# EAGLE design Lampen (EAGLE 9.2.0)
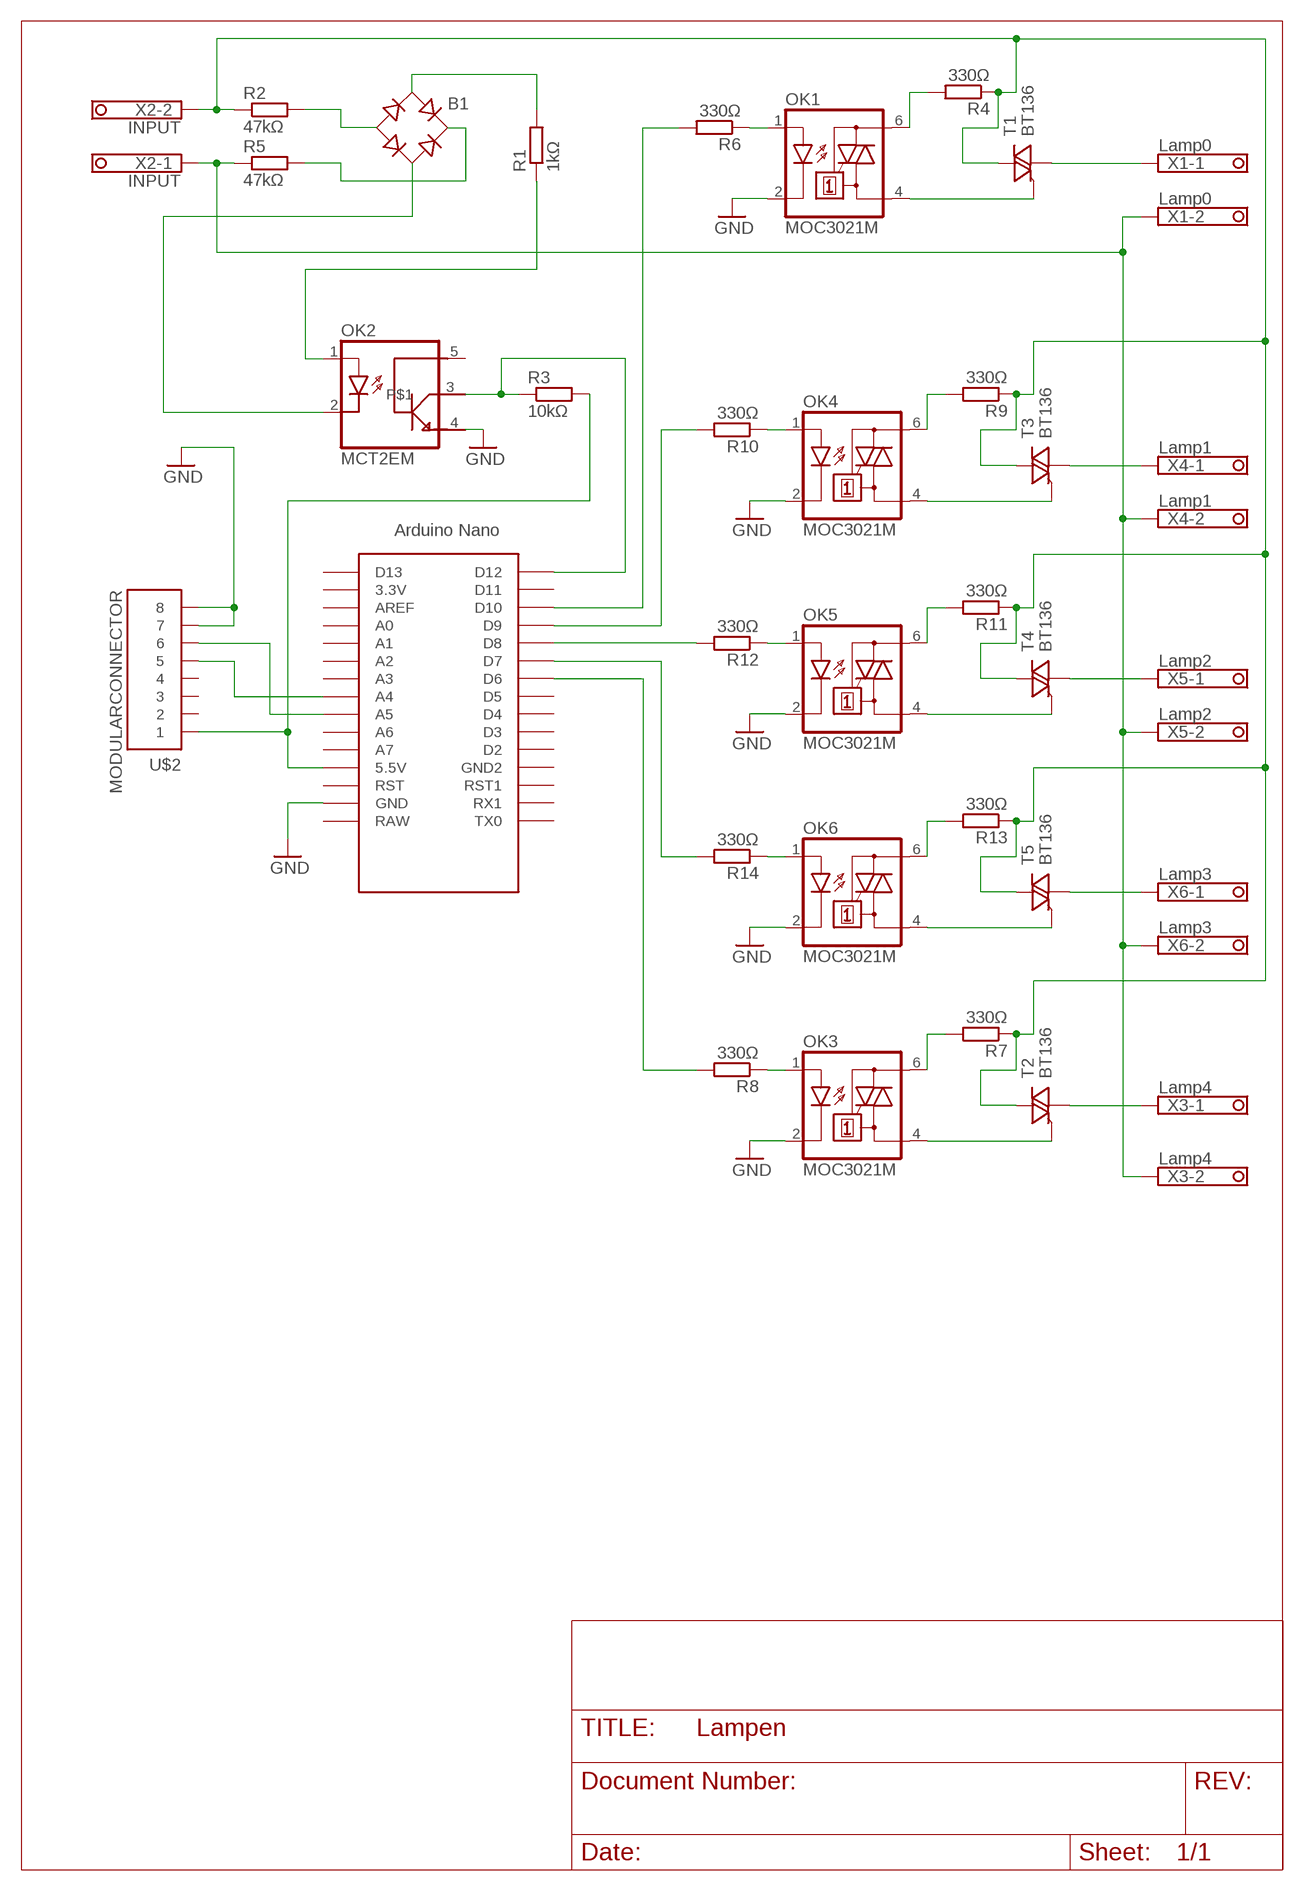
[diagram p0: schematic, sheet 1]

## Parts
B1  B250C1500G  [RB1A]
OK1  MOC3021M  MOC3021M10  [DIL06]
OK2  MCT2EM  MCT2EM21  [DIL06]
OK3  MOC3021M  MOC3021M10  [DIL06]
OK4  MOC3021M  MOC3021M10  [DIL06]
OK5  MOC3021M  MOC3021M10  [DIL06]
OK6  MOC3021M  MOC3021M10  [DIL06]
R1  1kΩ  R-EU_M1206  [M1206]
R2  47kΩ  R-EU_R2512  [R2512]
R3  10kΩ  R-EU_M1206  [M1206]
R4  330Ω  R-EU_M1206  [M1206]
R5  47kΩ  R-EU_R2512  [R2512]
R6  330Ω  R-EU_M1206  [M1206]
R7  330Ω  R-EU_M1206  [M1206]
R8  330Ω  R-EU_M1206  [M1206]
R9  330Ω  R-EU_M1206  [M1206]
R10  330Ω  R-EU_M1206  [M1206]
R11  330Ω  R-EU_M1206  [M1206]
R12  330Ω  R-EU_M1206  [M1206]
R13  330Ω  R-EU_M1206  [M1206]
R14  330Ω  R-EU_M1206  [M1206]
T1  BT136  [TO220DS]
T2  BT136  [TO220DS]
T3  BT136  [TO220DS]
T4  BT136  [TO220DS]
T5  BT136  [TO220DS]
U$1  NANO  [NANO]
U$2  MODULARCONNECTOR  [MA04-2]
X1  Lamp0  1751248  [1751248]
X2  INPUT  1751248  [1751248]
X3  Lamp4  1751248  [1751248]
X4  Lamp1  1751248  [1751248]
X5  Lamp2  1751248  [1751248]
X6  Lamp3  1751248  [1751248]

## Nets
GND: OK1.2(C) OK2.4(A1) OK3.2(C) OK4.2(C) OK5.2(C) OK6.2(C) U$1.GND U$2.7 U$2.8
N$1: B1.+ R5.2
N$2: R5.1 X1.2 X2.1 X3.2 X4.2 X5.2 X6.2
N$3: B1.AC1 R1.2
N$4: OK2.1(A) R1.1
N$5: B1.- R2.2
N$6: OK1.1(A) R6.1
N$7: B1.AC2 OK2.2(C)
N$8: OK2.3 R3.1 U$1.D12
N$9: R3.2 U$1.5V(5.5V) U$2.1
N$10: OK1.4(A1) T1.G
N$11: T1.A1 X1.1
N$12: U$1.A5 U$2.6
N$13: OK1.6(A2) R4.2
N$14: R6.2 U$1.D10
N$15: OK4.4(A1) T3.G
N$16: OK3.4(A1) T2.G
N$17: T2.A1 X3.1
N$18: U$1.A4 U$2.5
N$19: OK3.6(A2) R7.2
N$20: OK3.1(A) R8.1
N$21: T3.A1 X4.1
N$24: OK4.6(A2) R9.2
N$25: OK4.1(A) R10.1
N$26: R10.2 U$1.D9
N$27: OK5.4(A1) T4.G
N$28: T4.A1 X5.1
N$30: OK5.6(A2) R11.2
N$31: OK5.1(A) R12.1
N$33: OK6.4(A1) T5.G
N$34: T5.A1 X6.1
N$35: R2.1 R4.1 R7.1 R9.1 R11.1 R13.1 T1.A2 T2.A2 T3.A2 T4.A2 T5.A2 X2.2
N$36: OK6.6(A2) R13.2
N$37: OK6.1(A) R14.1
N$38: R14.2 U$1.D7
N$39: R8.2 U$1.D6
N$40: R12.2 U$1.D8
Unconnected: OK2.5(A2) U$1.3.3V U$1.A0 U$1.A1 U$1.A2 U$1.A3 U$1.A6 U$1.A7 U$1.AREF U$1.D2 U$1.D3 U$1.D4 U$1.D5 U$1.D11 U$1.D13 U$1.GND1(GND2) U$1.ICSP1 U$1.ICSP2 U$1.ICSP3 U$1.ICSP4 U$1.ICSP5 U$1.ICSP6 U$1.RAW U$1.RST U$1.RST1 U$1.RX1 U$1.TX0 U$2.2 U$2.3 U$2.4

## Library data of the parts
B1 = dimmer_lampen:B250C1500G: RECTIFIER 1 A
OK1 OK3-OK6 = dimmer_lampen:MOC3021M: RANDOM-PHASE OPTOISOLATORS TRIAC DRIVER OUTPUT Source: http://www.fairchildsemi.com MOC3020-M.pdf; MF: FAIRCHILD SEMICONDUCTOR; MPN: MOC3010-M; OC_FARNELL: 1505423; OC_NEWARK: 72K8892
OK2 = dimmer_lampen2:MCT2EM: RANDOM-PHASE OPTOISOLATORS TRIAC DRIVER OUTPUT; MF: FAIRCHILD SEMICONDUCTOR; MPN: MOC3021-M; OC_FARNELL: 1021365; OC_NEWARK: 95B7895
R1-R14 = rcl:R-EU_: RESISTOR, European symbol; SPICEPREFIX: R
T1-T5 = dimmer_lampen:BT136: TRIAC
U$1 = Arduino-clone:NANO: Arduino Nano
U$2 = Main_lib:MODULARCONNECTOR
X1-X6 = dimmer_lampen:1751248: MKDS 1/ 2-3,5 Printklemme Nennstrom: 10 A Bemessungsspannung: 160 V Raster: 3,5 mm Polzahl: 2 Montageart: Löten Anschlussart: Schraubanschluss Anschlussrichtung vom Leiter zur Platine: 0° Source: http://eshop.phoenixcontact.com .. 1751248.pdf

## Board
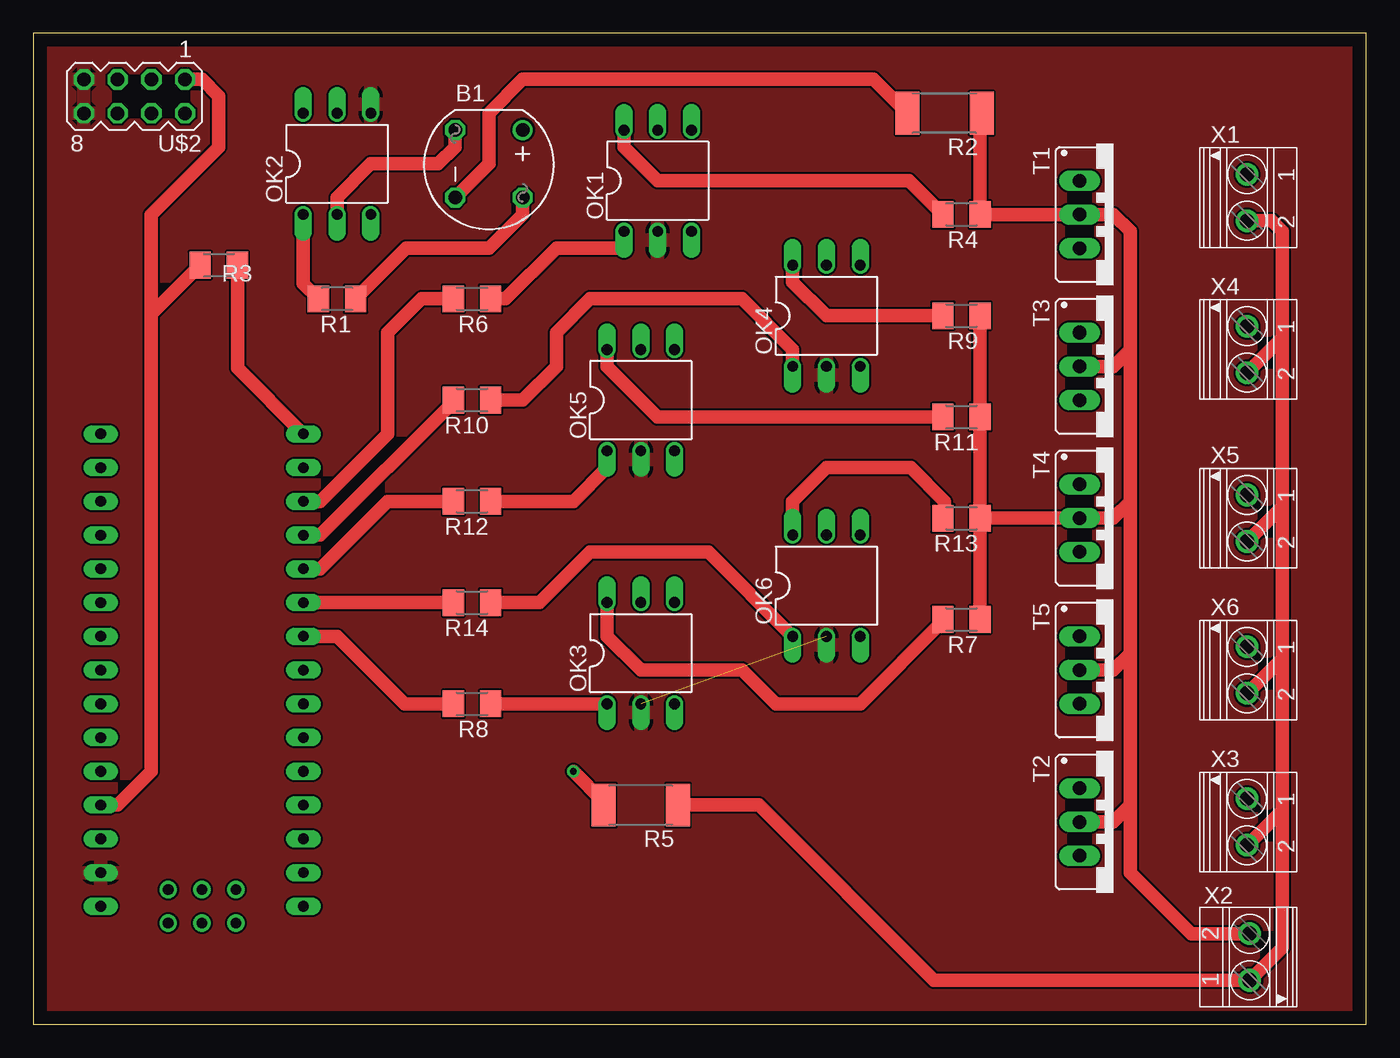
[diagram p1: board, top side]
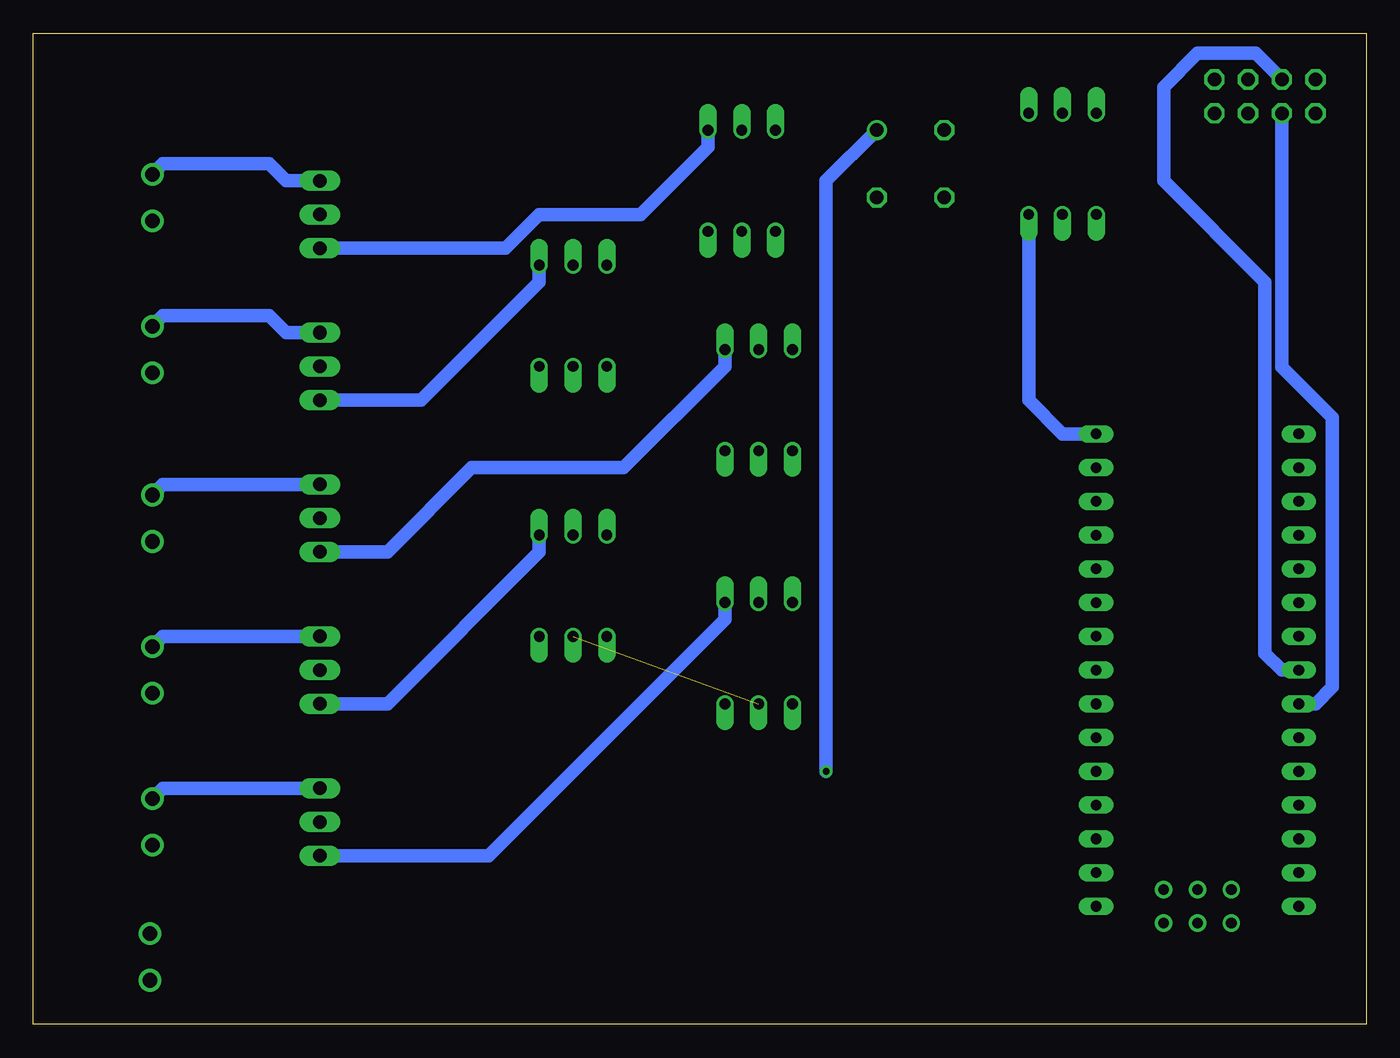
[diagram p2: board, bottom side, seen from below]

Size 100.31 x 74.6 mm. Coordinates in mm from the lower left corner, seen from the top.
Outline: 0,0 100.31,0 100.31,74.6 0,74.6 0,0
Copper layers (1*16): Top 0.035mm / dielectric 1.5mm / Bottom 0.035mm
Design rules "default": minimum track width 6mil, minimum drill 0.35mm, track to track 6mil, track to pad 6mil, pad to pad 6mil, via to via 6mil, smd to smd 6mil, copper to edge 40mil, drill to drill 6mil, minimum pad ring 10mil, minimum via ring 8mil, stop-mask expansion 4mil, vias tented up to drill 0mil, thermal gap 10mil

### Footprints (pad centres in the part's own frame; a part is rotated, then mirrored left to right if it is on the bottom)
RB1A = drill 1.016: + -2.54,2.54 | drill 1.016 octagon: - 2.54,-2.54; AC1 2.54,2.54; AC2 -2.54,-2.54
DIL06 = drill 0.813 offset: 1 -2.54,-3.81; 2 0,-3.81; 3 2.54,-3.81; 4 2.54,3.81; 5 0,3.81; 6 -2.54,3.81
M1206 = smd 1.6 x 2: 1 -1.4,0; 2 1.4,0
R2512 = smd 1.8 x 3.2: 1 -2.8,0; 2 2.8,0
TO220DS = drill 1.016 long: A1 -2.54,-2.54; A2 0,-2.54; G 2.54,-2.54
NANO = drill 0.8 long: 3.3V -10.16,24.13; 5V -10.16,-1.27; A0 -10.16,19.05; A1 -10.16,16.51; A2 -10.16,13.97; A3 -10.16,11.43; A4 -10.16,8.89; A5 -10.16,6.35; A6 -10.16,3.81; A7 -10.16,1.27; AREF -10.16,21.59; D2 5.08,1.27; D3 5.08,3.81; D4 5.08,6.35; D5 5.08,8.89; D6 5.08,11.43; D7 5.08,13.97; D8 5.08,16.51; D9 5.08,19.05; D10 5.08,21.59; D11 5.08,24.13; D12 5.08,26.67; D13 -10.16,26.67; GND -10.16,-6.35; GND1 5.08,-1.27; RAW -10.16,-8.89; RST -10.16,-3.81; RST1 5.08,-3.81; RX1 5.08,-6.35; TX0 5.08,-8.89 | drill 0.8: ICSP1 -5.08,-10.16; ICSP2 -5.08,-7.62; ICSP3 -2.54,-10.16; ICSP4 -2.54,-7.62; ICSP5 0,-10.16; ICSP6 0,-7.62
MA04-2 = drill 1.016 octagon: 1 -3.81,-1.27; 2 -3.81,1.27; 3 -1.27,-1.27; 4 -1.27,1.27; 5 1.27,-1.27; 6 1.27,1.27; 7 3.81,-1.27; 8 3.81,1.27
1751248 = drill 1.1 pad 1.7: 1 -1.75,-0.1; 2 1.75,-0.1

### Placement (x,y rotation side)
B1  34.29,64.77 270 top
OK1  46.99,63.5 0 top
OK2  22.86,64.77 0 top
OK3  45.72,27.94 0 top
OK4  59.69,53.34 0 top
OK5  45.72,46.99 0 top
OK6  59.69,33.02 0 top
R1  22.86,54.61 0 top
R2  68.58,68.58 180 top
R3  13.97,57.15 180 top
R4  69.85,60.96 180 top
R5  45.72,16.51 180 top
R6  33.02,54.61 180 top
R7  69.85,30.48 180 top
R8  33.02,24.13 180 top
R9  69.85,53.34 180 top
R10  33.02,46.99 180 top
R11  69.85,45.72 180 top
R12  33.02,39.37 180 top
R13  69.85,38.1 180 top
R14  33.02,31.75 180 top
T1  81.28,60.96 270 top
T2  81.28,15.24 270 top
T3  81.28,49.53 270 top
T4  81.28,38.1 270 top
T5  81.28,26.67 270 top
U$1  15.24,17.78 0 top
U$2  7.62,69.85 180 top
X1  91.44,62.23 270 top
X2  91.44,5.08 90 top
X3  91.44,15.24 270 top
X4  91.44,50.8 270 top
X5  91.44,38.1 270 top
X6  91.44,26.67 270 top

### Tracks (layer width: path | path; a pad name or v marks a point on that pad's centre or on a via)
GND  (1 unrouted)
  pour Top: 0,73.66 0,0 100.33,0 100.33,74.93 0,74.93
N$1  (via drill 0.5)
  Top 1: R5.2 42.92,16.77 v40.64,19.05
  Bottom 1: B1.+ 40.64,63.5 v40.64,19.05
N$2
  Top 1: X1.2 93.19,60.48 93.98,59.69 93.98,51.69 | 93.98,51.69 93.98,38.99 | 93.98,38.99 93.98,27.56 | 93.98,27.56 93.98,16.13 | 93.98,16.13 X3.2 | 93.98,27.56 X6.2 | 93.98,38.99 X5.2 | 93.98,51.69 X4.2 | 93.98,16.13 93.98,5.77 X2.1 67.79,3.33 54.61,16.51 R5.1
N$3
  Top 1: R1.2 28.07,58.42 34.29,58.42 36.83,60.96 B1.AC1
N$4
  Top 1: OK2.1 20.32,55.75 R1.1
N$5
  Top 1: B1.- 34.29,64.77 34.29,68.58 36.83,71.12 63.24,71.12 R2.2
N$6
  Top 1: R6.1 35.56,54.61 39.37,58.42 44.45,58.42 OK1.1
N$7
  Top 1: OK2.2 22.86,62.23 25.4,64.77 30.48,64.77 31.75,66.04 B1.AC2
N$8
  Top 1: U$1.D12 15.37,49.4 R3.1
  Bottom 1: U$1.D12 22.86,44.45 25.4,46.99 OK2.3
N$9
  Top 1: U$2.1 12.7,71.12 13.97,69.85 13.97,66.04 8.89,60.96 8.89,53.47 | U$1.5V 6.35,16.51 8.89,19.05 8.89,50.8 8.89,53.47 | R3.2 8.89,53.47
N$10
  Bottom 1: OK1.4 49.53,66.04 54.61,60.96 62.23,60.96 64.77,58.42 T1.G
N$11
  Bottom 1: T1.A1 81.28,63.5 82.55,64.77 90.55,64.77 X1.1
N$12
  Bottom 1: U$2.6 6.35,49.49 2.54,45.68 2.54,25.4 3.81,24.13 U$1.A5
N$13
  Top 1: OK1.6 44.45,66.04 46.99,63.5 65.91,63.5 R4.2
N$14
  Top 1: U$1.D10 21.59,39.37 26.67,44.45 26.67,52.07 29.21,54.61 R6.2
N$15
  Bottom 1: OK4.4 62.23,55.88 71.12,46.99 T3.G
N$16
  Bottom 1: OK3.4 48.26,30.48 66.04,12.7 T2.G
N$17
  Bottom 1: T2.A1 90.55,17.78 X3.1
N$18
  Bottom 1: U$2.5 8.31,73.08 12.7,73.08 15.24,70.54 15.24,63.5 7.62,55.88 7.62,27.94 6.35,26.67 U$1.A4
N$19
  Top 1: OK3.6 43.18,29.21 45.72,26.67 53.34,26.67 55.88,24.13 62.23,24.13 68.45,30.35 R7.2
N$20
  Top 1: R8.1 OK3.1
N$21
  Bottom 1: T3.A1 81.28,52.07 82.55,53.34 90.55,53.34 X4.1
N$24
  Top 1: OK4.6 57.15,55.88 59.69,53.34 R9.2
N$25
  Top 1: R10.1 36.83,46.99 39.37,49.53 39.37,52.07 41.91,54.61 53.34,54.61 57.15,50.8 OK4.1
N$26
  Top 1: U$1.D9 21.59,36.83 31.62,46.86 R10.2
N$27
  Bottom 1: OK5.4 48.26,49.53 55.88,41.91 67.31,41.91 73.66,35.56 T4.G
N$28
  Bottom 1: T4.A1 90.55,40.64 X5.1
N$30
  Top 1: OK5.6 43.18,49.53 46.99,45.72 R11.2
N$31
  Top 1: OK5.1 43.18,41.91 40.64,39.37 R12.1
N$33
  Bottom 1: OK6.4 62.23,35.56 73.66,24.13 T5.G
N$34
  Bottom 1: T5.A1 90.55,29.21 X6.1
N$35
  Top 1: 80.01,15.24 T2.A2 81.28,15.24 82.55,16.51 | 82.55,50.8 82.55,59.69 81.28,60.96 T1.A2 R4.1 71.25,68.45 R2.1 | 82.55,50.8 82.55,39.37 | 82.55,39.37 82.55,27.94 | 82.55,27.94 82.55,16.51 | 82.55,16.51 82.55,12.7 82.55,12.12 82.55,11.43 87.15,6.83 X2.2 | 80.01,26.67 T5.A2 81.28,26.67 82.55,27.94 | 80.01,38.1 T4.A2 | T3.A2 81.28,49.53 82.55,50.8 | T4.A2 81.28,38.1 82.55,39.37 | R13.1 R11.1 R9.1 | R7.1 R13.1 | T4.A2 R13.1 | 71.12,38.1 R13.1
N$36
  Top 1: OK6.6 57.15,39.37 59.69,41.91 66.04,41.91 68.58,39.37 68.58,38.23 R13.2
N$37
  Top 1: R14.1 38.1,31.75 41.91,35.56 50.8,35.56 OK6.1
N$38
  Top 1: U$1.D7 R14.2 31.75,31.75
N$39
  Top 1: U$1.D6 22.86,29.21 27.94,24.13 R8.2
N$40
  Top 1: U$1.D8 21.59,34.29 26.67,39.37 R12.2